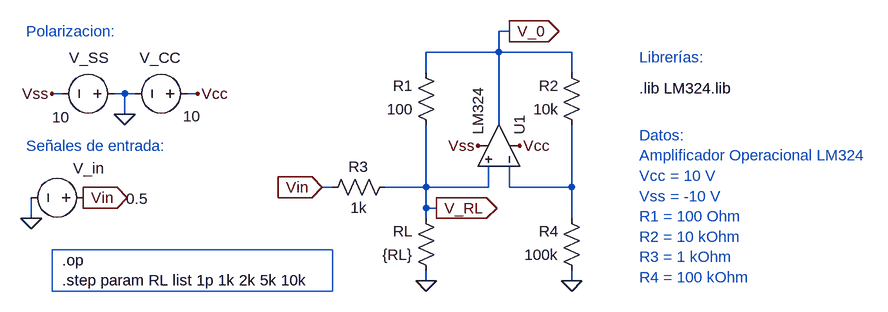
[diagram p0: schematic Lab_1_Circ_2_Vin(cc)=0.5.asc]
Lab_1_Circ_2_Vin(cc)=0.5.asc, the LTspice schematic file:
Version 4
SHEET 1 1560 680
WIRE 384 -256 368 -256
WIRE 368 -224 368 -256
WIRE 368 -224 256 -224
WIRE 480 -224 368 -224
WIRE 256 -192 256 -224
WIRE 480 -192 480 -224
WIRE -304 -160 -320 -160
WIRE -208 -160 -224 -160
WIRE -192 -160 -208 -160
WIRE -96 -160 -112 -160
WIRE -208 -128 -208 -160
WIRE 368 -112 368 -224
WIRE 112 -16 96 -16
WIRE 256 -16 256 -112
WIRE 256 -16 192 -16
WIRE 352 -16 352 -48
WIRE 352 -16 256 -16
WIRE 384 -16 384 -48
WIRE 480 -16 480 -112
WIRE 480 -16 384 -16
WIRE 256 16 256 -16
WIRE 272 16 256 16
WIRE -352 32 -352 0
WIRE 256 32 256 16
WIRE 480 32 480 -16
WIRE 256 128 256 112
WIRE 480 128 480 112
FLAG 256 128 0
FLAG -96 -160 Vcc
FLAG 400 -80 Vcc
FLAG -320 -160 Vss
FLAG 336 -80 Vss
FLAG -208 -128 0
FLAG -352 32 0
FLAG 384 -256 V_0
IOPIN 384 -256 Out
FLAG 96 -16 Vin
IOPIN 96 -16 In
FLAG -272 0 Vin
IOPIN -272 0 Out
FLAG 480 128 0
FLAG 272 16 V_RL
IOPIN 272 16 Out
SYMBOL OpAmps\\opamp2 432 -80 M270
SYMATTR InstName U1
SYMATTR Value LM324
SYMBOL res 272 -96 R180
WINDOW 0 36 76 Left 2
WINDOW 3 36 40 Left 2
SYMATTR InstName R1
SYMATTR Value 100
SYMBOL res 496 -96 R180
WINDOW 0 36 76 Left 2
WINDOW 3 36 40 Left 2
SYMATTR InstName R2
SYMATTR Value 10k
SYMBOL res 208 -32 R90
WINDOW 0 0 56 VBottom 2
WINDOW 3 32 56 VTop 2
SYMATTR InstName R3
SYMATTR Value 1k
SYMBOL res 496 128 R180
WINDOW 0 36 76 Left 2
WINDOW 3 36 40 Left 2
SYMATTR InstName R4
SYMATTR Value 100k
SYMBOL res 272 128 R180
WINDOW 0 36 76 Left 2
WINDOW 3 36 40 Left 2
SYMATTR InstName RL
SYMATTR Value {RL}
SYMBOL voltage -256 0 M270
WINDOW 0 45 31 VLeft 2
WINDOW 3 -2 -50 VLeft 2
WINDOW 123 0 0 Left 0
WINDOW 39 0 0 Left 0
SYMATTR InstName V_in
SYMATTR Value 0.5
SYMBOL voltage -96 -160 R90
WINDOW 0 -55 25 VRight 2
WINDOW 3 35 -5 VRight 2
WINDOW 123 0 0 Left 0
WINDOW 39 0 0 Left 0
SYMATTR InstName V_CC
SYMATTR Value 10
SYMBOL voltage -208 -160 R90
WINDOW 0 -55 25 VRight 2
WINDOW 3 36 85 VRight 2
WINDOW 123 0 0 Left 0
WINDOW 39 0 0 Left 0
SYMATTR InstName V_SS
SYMATTR Value 10
TEXT 584 -168 Left 2 !.lib LM324.lib
TEXT 584 -216 Left 2 ;Librerías:
TEXT -360 -256 Left 2 ;Polarizacion:
TEXT -360 -80 Left 2 ;Señales de entrada:
TEXT 584 -96 Left 2 ;Datos:\nAmplificador Operacional LM324\nVcc = 10 V\nVss = -10 V\nR1 = 100 Ohm\nR2 = 10 kOhm\nR3 = 1 kOhm\nR4 = 100 kOhm
TEXT -304 96 Left 2 !.op\n.step param RL list 1p 1k 2k 5k 10k
RECTANGLE Normal 112 144 -320 80

The netlist it stands for:
* Lab_1_Circ_2_Vin(cc)=0.5.asc
XU1 V_RL N001 Vcc Vss V_0 LM324  ; pins In+ In- V+ V- OUT
R1 V_RL V_0 100
R2 N001 V_0 10k
R3 V_RL Vin 1k
R4 0 N001 100k
RL 0 V_RL {RL}
V_in Vin 0 0.5
V_CC Vcc 0 10
V_SS 0 Vss 10
.lib LM324.lib
* Librerías:
* Polarizacion:
* Señales de entrada:
* Datos:
* Amplificador Operacional LM324
* Vcc = 10 V
* Vss = -10 V
* R1 = 100 Ohm
* R2 = 10 kOhm
* R3 = 1 kOhm
* R4 = 100 kOhm
.op
.step param RL list 1p 1k 2k 5k 10k
.backanno
.end

* Results of the author's LTspice run, read from the files saved beside the schematic
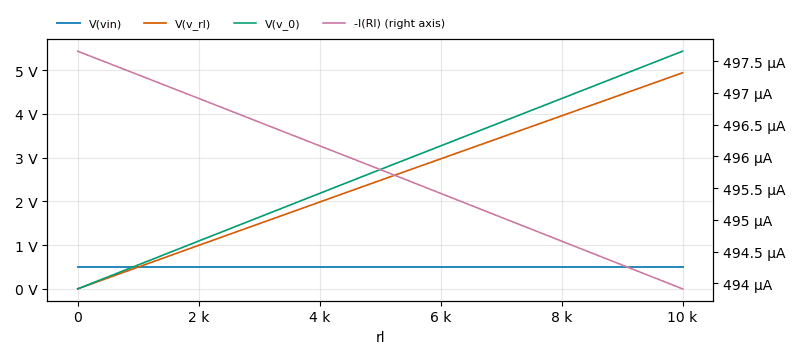
[diagram p1: Operating Point of Lab_1_Circ_2_Vin(cc)=0.5.asc, plotted from the saved traces]
* Operating Point, 1 run:
*   V(vin): 500 mV at rl=1 p, 500 mV at rl=10 k, min 500 mV, max 500 mV
*   V(v_rl): 0.4977 fV at rl=1 p, 4.939 V at rl=10 k, min 0.4977 fV, max 4.939 V
*   V(v_0): -236.4 µV at rl=1 p, 5.432 V at rl=10 k, min -236.4 µV, max 5.432 V
*   -I(Rl): 497.7 µA at rl=1 p, 493.9 µA at rl=10 k, min 493.9 µA, max 497.7 µA